# EAGLE design Xonik Waveshaper v2.0 (EAGLE 9.5.2)
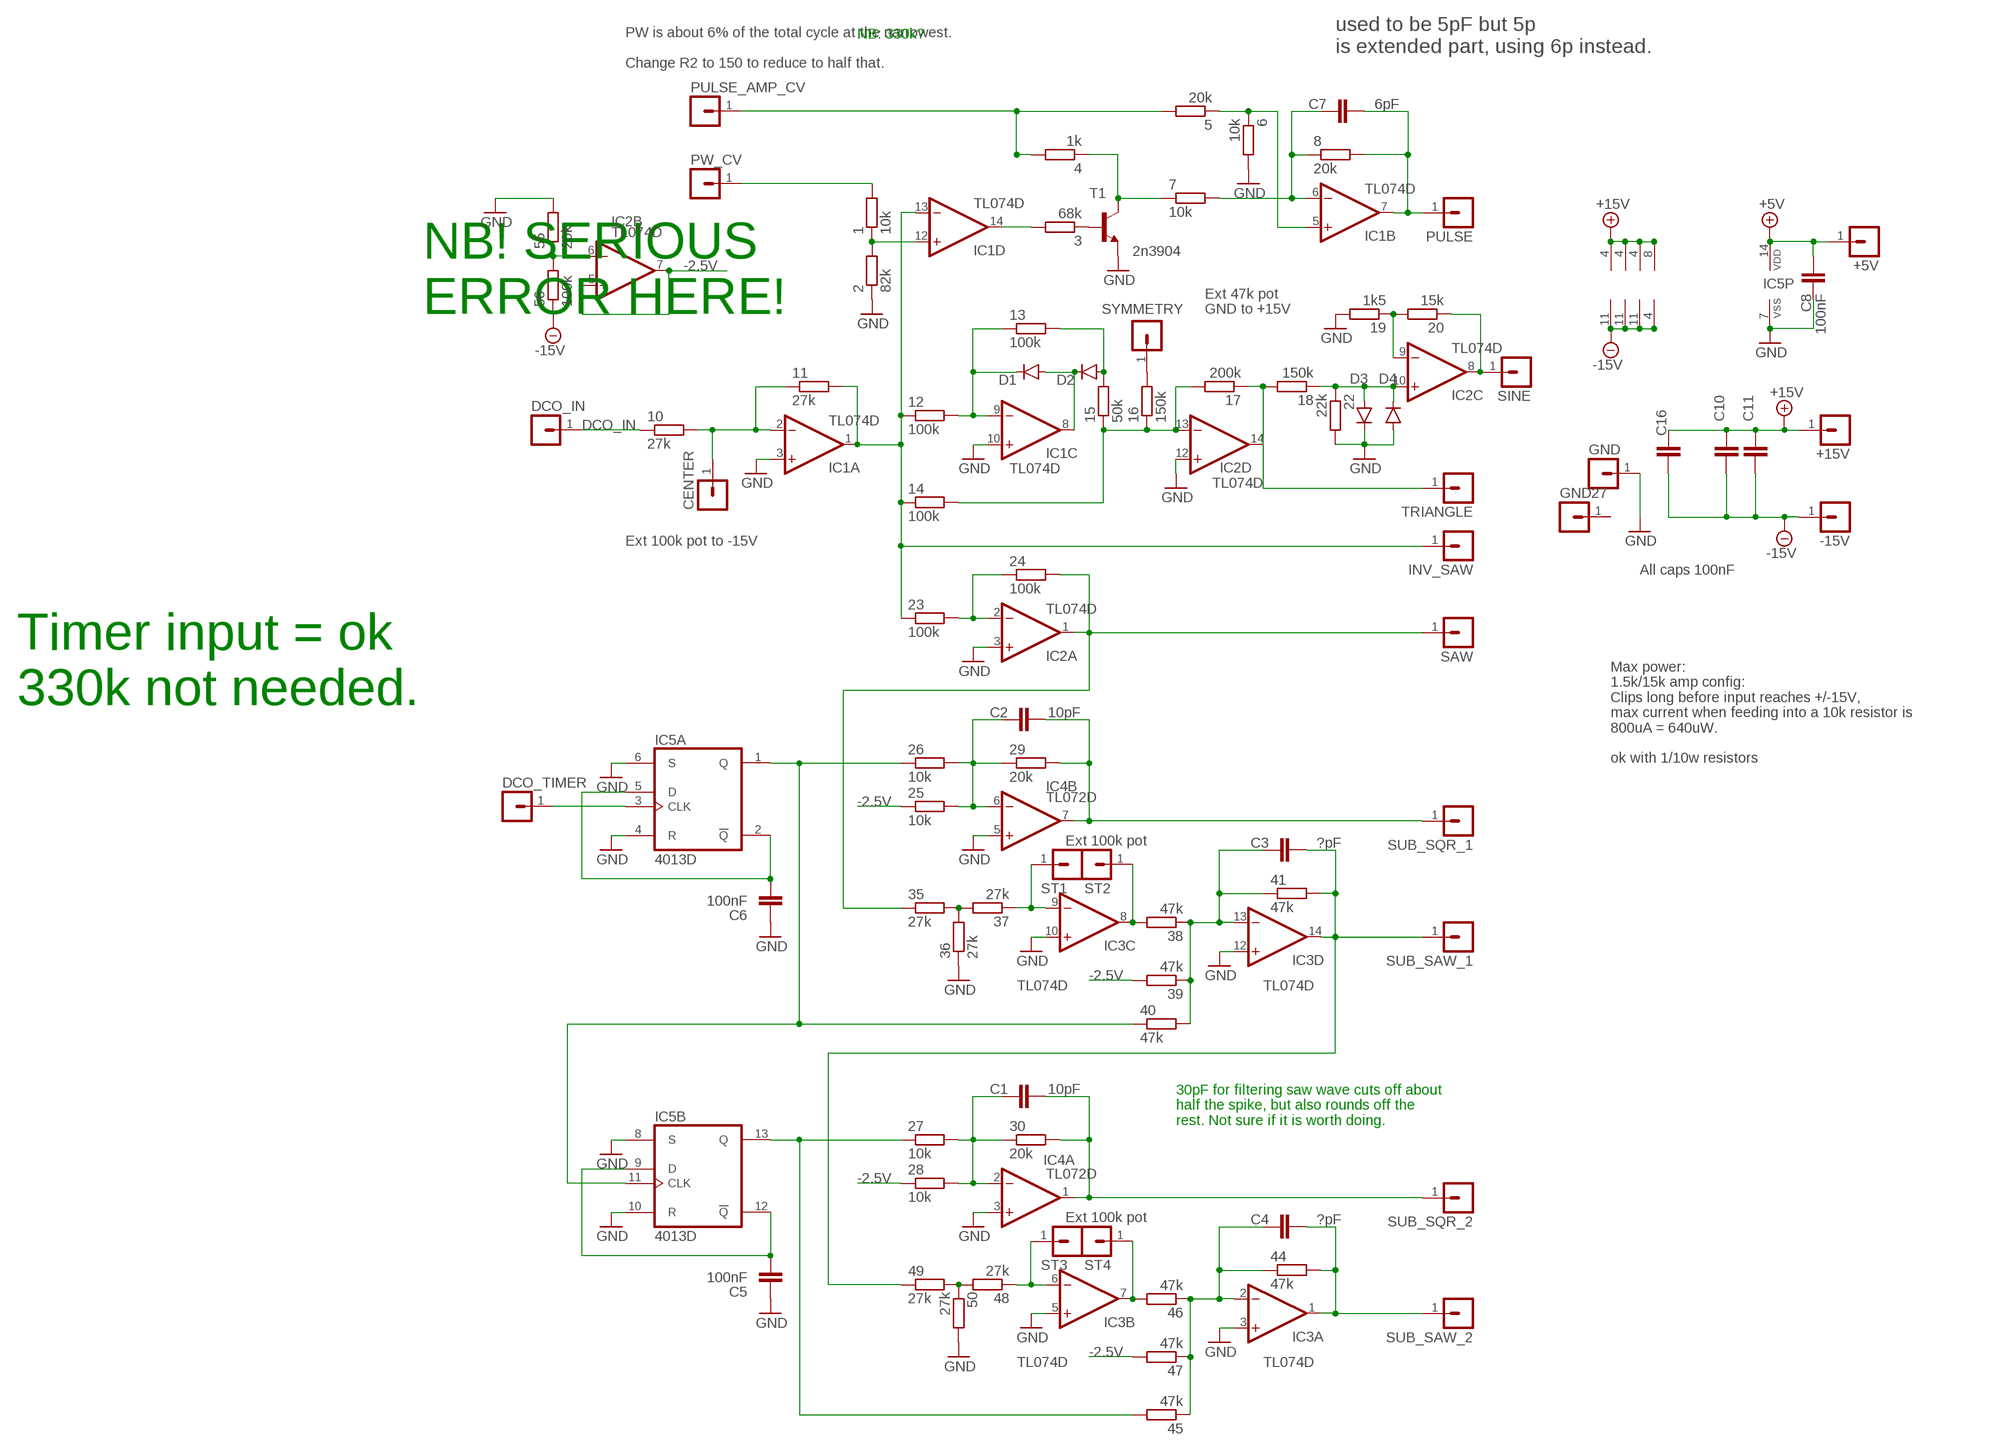
[diagram p0: schematic, sheet 1]

## Parts
1  10k  R-EU_R0805  [R0805]
2  82k  R-EU_R0805  [R0805]
3  68k  R-EU_R0805  [R0805]
4  1k  R-EU_R0805  [R0805]
5  20k  R-EU_R0805  [R0805]
6  10k  R-EU_R0805  [R0805]
7  10k  R-EU_R0805  [R0805]
8  20k  R-EU_R0805  [R0805]
10  27k  R-EU_R0805  [R0805]
11  27k  R-EU_R0805  [R0805]
12  100k  R-EU_R0805  [R0805]
13  100k  R-EU_R0805  [R0805]
14  100k  R-EU_R0805  [R0805]
15  50k  R-EU_R0805  [R0805]
16  150k  R-EU_R0805  [R0805]
17  200k  R-EU_R0805  [R0805]
18  150k  R-EU_R0805  [R0805]
19  1k5  R-EU_R0805  [R0805]
20  15k  R-EU_R0805  [R0805]
22  22k  R-EU_R0805  [R0805]
23  100k  R-EU_R0805  [R0805]
24  100k  R-EU_R0805  [R0805]
25  10k  R-EU_R0805  [R0805]
26  10k  R-EU_R0805  [R0805]
27  10k  R-EU_R0805  [R0805]
28  10k  R-EU_R0805  [R0805]
29  20k  R-EU_R0805  [R0805]
30  20k  R-EU_R0805  [R0805]
35  27k  R-EU_R0805  [R0805]
36  27k  R-EU_R0805  [R0805]
37  27k  R-EU_R0805  [R0805]
38  47k  R-EU_R0805  [R0805]
39  47k  R-EU_R0805  [R0805]
40  47k  R-EU_R0805  [R0805]
41  47k  R-EU_R0805  [R0805]
44  47k  R-EU_R0805  [R0805]
45  47k  R-EU_R0805  [R0805]
46  47k  R-EU_R0805  [R0805]
47  47k  R-EU_R0805  [R0805]
48  27k  R-EU_R0805  [R0805]
49  27k  R-EU_R0805  [R0805]
50  27k  R-EU_R0805  [R0805]
55  20k  R-EU_R0805  [R0805]
56  100k  R-EU_R0805  [R0805]
+5V  MA01-1JP  [SIP-PIN01-1J]
+15V  MA01-1JP  [SIP-PIN01-1J]
-15V  MA01-1JP  [SIP-PIN01-1J]
C1  10pF  C-EUC0805  [C0805]
C2  10pF  C-EUC0805  [C0805]
C3  ?pF  C-EUC0805  [C0805]
C4  ?pF  C-EUC0805  [C0805]
C5  100nF  C-EUC0805  [C0805]
C6  100nF  C-EUC0805  [C0805]
C7  6pF  C-EUC0805  [C0805]
C8  100nF  C-EUC0805  [C0805]
C10  100nF  C-EUC0603K  [C0603K]
C11  100nF  C-EUC0603K  [C0603K]
C16  100nF  C-EUC0603K  [C0603K]
CENTER  MA01-1JP  [SIP-PIN01-1J]
D1  1N41480805  [D0805-J]
D2  1N41480805  [D0805-J]
D3  1N41480805  [D0805-J]
D4  1N41480805  [D0805-J]
DCO_IN  MA01-1JP  [SIP-PIN01-1J]
DCO_TIMER  MA01-1JP  [SIP-PIN01-1J]
GND  MA01-1JP  [SIP-PIN01-1J]
GND27  MA01-1JP  [SIP-PIN01-1J]
IC1  TL074D  [SO14]
IC2  TL074D  [SO14]
IC3  TL074D  [SO14]
IC4  TL072D  [SO08J]
IC5  4013D  [SO14J]
INV_SAW  MA01-1JP  [SIP-PIN01-1J]
PULSE  MA01-1JP  [SIP-PIN01-1J]
PULSE_AMP_CV  MA01-1JP  [SIP-PIN01-1J]
PW_CV  MA01-1JP  [SIP-PIN01-1J]
SAW  MA01-1JP  [SIP-PIN01-1J]
SINE  MA01-1JP  [SIP-PIN01-1J]
ST1  MA01-1JP  [SIP-PIN01-1J]
ST2  MA01-1JP  [SIP-PIN01-1J]
ST3  MA01-1JP  [SIP-PIN01-1J]
ST4  MA01-1JP  [SIP-PIN01-1J]
SUB_SAW_1  MA01-1JP  [SIP-PIN01-1J]
SUB_SAW_2  MA01-1JP  [SIP-PIN01-1J]
SUB_SQR_1  MA01-1JP  [SIP-PIN01-1J]
SUB_SQR_2  MA01-1JP  [SIP-PIN01-1J]
SYMMETRY  MA01-1JP  [SIP-PIN01-1J]
T1  2n3904  MMBT3904LT1-NPN-SOT23-BEC  [SOT23-BEC]
TRIANGLE  MA01-1JP  [SIP-PIN01-1J]

## Nets
+5V: +5V.1 C8.2 IC5.14(P:VDD)
+15V: +15V.1 C10.2 C11.2 C16.2 IC1.4(P:V+) IC2.4(P:V+) IC3.4(P:V+) IC4.8(P:V+)
-2.5V: 25.1 28.1 39.2 47.2 IC2.5(B:+IN) IC2.7(B:OUT)
-15V: 56.1 -15V.1 C10.1 C11.1 C16.1 IC1.11(P:V-) IC2.11(P:V-) IC3.11(P:V-) IC4.4(P:V-)
AMP_CV: 4.2 5.2 PULSE_AMP_CV.1
DCO_IN: 10.1 DCO_IN.1
GND: 2.1 6.2 19.2 22.2 36.1 50.2 55.2 C5.1 C6.1 C8.1 D3.C D4.A GND.1 IC1.3(A:+IN) IC1.10(C:+IN) IC2.3(A:+IN) IC2.12(D:+IN) IC3.3(A:+IN) IC3.5(B:+IN) IC3.10(C:+IN) IC3.12(D:+IN) IC4.3(A:+IN) IC4.5(B:+IN) IC5.4(A:R) IC5.6(A:S) IC5.7(P:VSS) IC5.8(B:S) IC5.10(B:R) T1.E
N$1: 1.1 2.2 IC1.12(D:+IN)
N$2: 3.2 IC1.14(D:OUT)
N$3: 3.1 T1.B
N$4: 4.1 7.1 T1.C
N$5: 5.1 6.1 IC1.5(B:+IN)
N$6: 7.2 8.1 C7.1 IC1.6(B:-IN)
N$7: 8.2 C7.2 IC1.7(B:OUT) PULSE.1
N$9: 11.2 12.1 14.1 23.1 IC1.1(A:OUT) IC1.13(D:-IN) INV_SAW.1
N$10: 10.2 11.1 CENTER.1 IC1.2(A:-IN)
N$11: 12.2 13.1 D1.C IC1.9(C:-IN)
N$12: D1.A D2.C IC1.8(C:OUT)
N$13: 13.2 15.2 D2.A
N$14: 14.2 15.1 16.1 17.2 IC2.13(D:-IN)
N$15: 23.2 24.1 IC2.2(A:-IN)
N$16: 24.2 35.1 IC2.1(A:OUT) SAW.1
N$17: 29.2 C2.2 IC4.7(B:OUT) SUB_SQR_1.1
N$18: 30.2 C1.2 IC4.1(A:OUT) SUB_SQR_2.1
N$19: 25.2 26.2 29.1 C2.1 IC4.6(B:-IN)
N$20: 46.2 IC3.7(B:OUT) ST4.1
N$21: 48.2 49.2 50.1
N$22: 27.2 28.2 30.1 C1.1 IC4.2(A:-IN)
N$23: 35.2 36.2 37.2
N$24: 37.1 IC3.9(C:-IN) ST1.1
N$26: 38.1 39.1 40.2 41.1 C3.1 IC3.13(D:-IN)
N$27: 41.2 49.1 C3.2 IC3.14(D:OUT) SUB_SAW_1.1
N$28: 48.1 IC3.6(B:-IN) ST3.1
N$29: 44.1 45.1 46.1 47.1 C4.1 IC3.2(A:-IN)
N$30: 44.2 C4.2 IC3.1(A:OUT) SUB_SAW_2.1
N$31: C6.2 IC5.2(A:!Q) IC5.5(A:D)
N$32: 26.1 40.1 IC5.1(A:Q) IC5.11(B:CLK)
N$33: 55.1 56.2 IC2.6(B:-IN)
N$34: C5.2 IC5.9(B:D) IC5.12(B:!Q)
N$35: 27.1 45.2 IC5.13(B:Q)
N$36: 19.1 20.2 IC2.9(C:-IN)
N$37: 16.2 SYMMETRY.1
N$38: 17.1 18.2 IC2.14(D:OUT) TRIANGLE.1
N$39: 18.1 22.1 D3.A D4.C IC2.10(C:+IN)
N$40: 20.1 IC2.8(C:OUT) SINE.1
N$41: 38.2 IC3.8(C:OUT) ST2.1
PW_CV: 1.2 PW_CV.1
SQR: DCO_TIMER.1 IC5.3(A:CLK)
Unconnected: GND27.1

## Notes on the sheet
- NB: 330k?
- used to be 5pF but 5p
  is extended part, using 6p instead.
- PW is about 6% of the total cycle at the narrowest.
  
  Change R2 to 150 to reduce to half that.
- NB! SERIOUS
  ERROR HERE!
- Ext 47k pot 
  GND to +15V
- Ext 100k pot to -15V
- All caps 100nF
- Timer input = ok
  330k not needed.
- Max power:
  1.5k/15k amp config:
  Clips long before input reaches +/-15V,
  max current when feeding into a 10k resistor is
  800uA = 640uW. 
  
  ok with 1/10w resistors
- Ext 100k pot
- 30pF for filtering saw wave cuts off about
  half the spike, but also rounds off the
  rest. Not sure if it is worth doing.
- Ext 100k pot

## Library data of the parts
1-8 10-20 22-30 35-41 44-50 55 56 = resistor:R-EU_: RESISTOR, European symbol
+5V +15V -15V CENTER DCO_IN DCO_TIMER GND GND27 INV_SAW PULSE PULSE_AMP_CV PW_CV SAW SINE ST1-ST4 SUB_SAW_1 SUB_SAW_2 SUB_SQR_1 SUB_SQR_2 SYMMETRY TRIANGLE = joakim:MA01-1J: PIN HEADER
C1-C8 C10 C11 C16 = resistor:C-EU: CAPACITOR, European symbol
D1-D4 = joakim:1N4148: DIODE high speed (Philips)
IC1-IC3 = linear:TL074: OP AMP
IC4 = joakim:TL072: OP AMP
IC5 = joakim:4013: Dual D FLIP FLOP, set/reset
T1 = transistor-neu-to92:*-NPN-: NPN Transistror

## Board
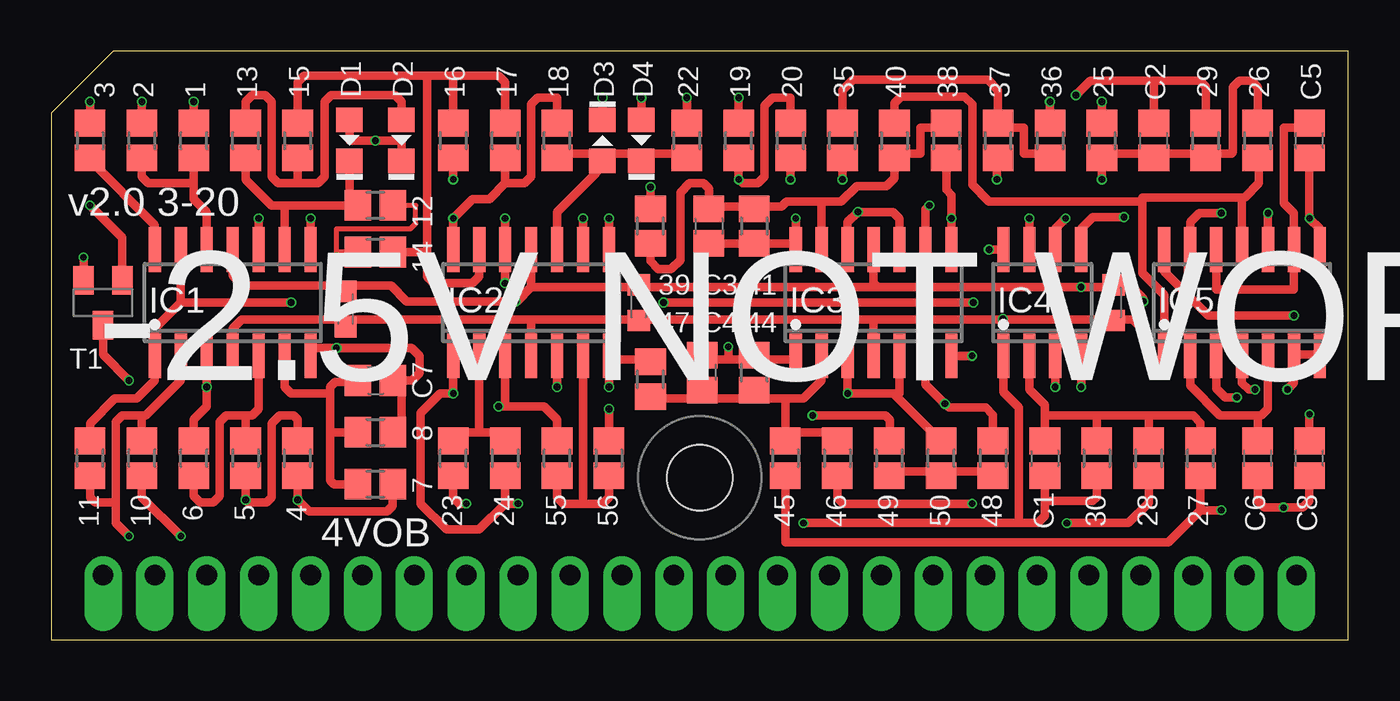
[diagram p1: board, top side]
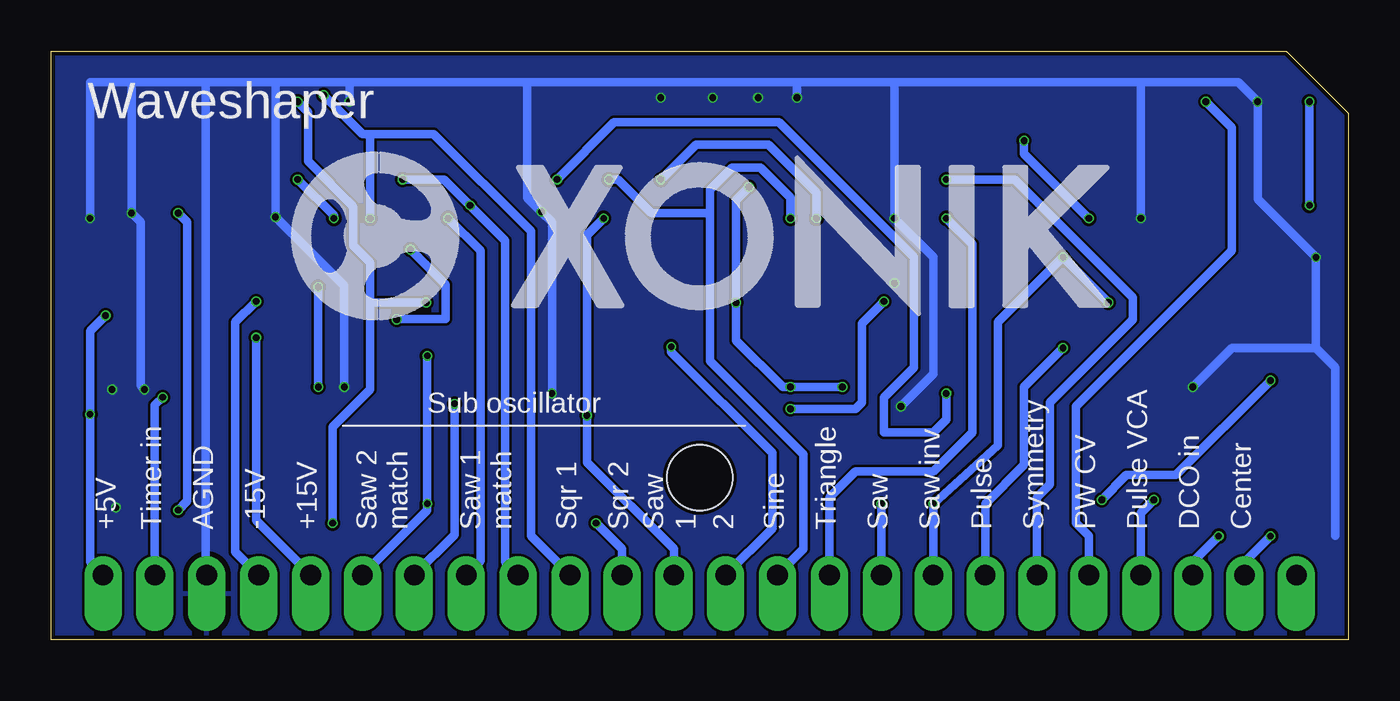
[diagram p2: board, bottom side, seen from below]

Size 63.5 x 28.83 mm. Coordinates in mm from the lower left corner, seen from the top.
Outline: 0,0 63.5,0 63.5,28.83 3.05,28.83 0,25.78 0,0
Copper layers (1*16): Top 0.035mm / dielectric 1.6mm / Bottom 0.035mm
Design rules "jlcpcb-2layers": minimum track width 5mil, minimum drill 0.3mm, track to track 5mil, track to pad 5mil, pad to pad 5mil, via to via 5mil, smd to smd 5mil, copper to edge 0.2mm, drill to drill 6mil, minimum pad ring 10mil, minimum via ring 3mil, stop-mask expansion 4mil, vias tented up to drill 0mil, thermal gap 10mil
Holes 3.2 mm at 31.75,7.94

### Footprints (pad centres in the part's own frame; a part is rotated, then mirrored left to right if it is on the bottom)
R0805 = smd 1.3 x 1.5: 1 -0.85,0; 2 0.85,0
SIP-PIN01-1J = drill 1.016 offset: 1 0,0
C0805 = smd 1.3 x 1.5: 1 -0.85,0; 2 0.85,0
C0603K = smd 1.05 x 1.08: 1 -0.875,0; 2 0.875,0
D0805-J = smd 1.2 x 1.3: A -1,0; C 1,0
SO14 = smd 0.6 x 2.2: 1 -3.81,-2.6; 2 -2.54,-2.6; 3 -1.27,-2.6; 4 0,-2.6; 5 1.27,-2.6; 6 2.54,-2.6; 7 3.81,-2.6; 8 3.81,2.6; 9 2.54,2.6; 10 1.27,2.6; 11 0,2.6; 12 -1.27,2.6; 13 -2.54,2.6; 14 -3.81,2.6
SO08J = smd 0.6 x 2.2: 1 -1.905,-2.6; 2 -0.635,-2.6; 3 0.635,-2.6; 4 1.905,-2.6; 5 1.905,2.6; 6 0.635,2.6; 7 -0.635,2.6; 8 -1.905,2.6
SO14J = smd 0.6 x 2.2: 1 -3.81,-2.6; 2 -2.54,-2.6; 3 -1.27,-2.6; 4 0,-2.6; 5 1.27,-2.6; 6 2.54,-2.6; 7 3.81,-2.6; 8 3.81,2.6; 9 2.54,2.6; 10 1.27,2.6; 11 0,2.6; 12 -1.27,2.6; 13 -2.54,2.6; 14 -3.81,2.6
SOT23-BEC = smd 1 x 1.4: B -0.95,-1.1; C 0,1.1; E 0.95,-1.1

### Placement (x,y rotation side)
1  6.99,24.45 90 top
2  4.45,24.45 270 top
3  1.91,24.45 270 top
4  12.06,8.89 90 top
5  9.53,8.89 270 top
6  6.99,8.89 90 top
7  15.88,7.62 180 top
8  15.88,10.16 0 top
10  4.45,8.89 90 top
11  1.91,8.89 90 top
12  15.88,21.27 180 top
13  9.53,24.45 90 top
14  15.88,18.99 0 top
15  12.06,24.45 270 top
16  19.68,24.45 270 top
17  22.23,24.45 90 top
18  24.77,24.45 90 top
19  33.66,24.45 90 top
20  36.2,24.45 90 top
22  31.11,24.45 90 top
23  19.68,8.89 90 top
24  22.23,8.89 270 top
25  51.44,24.45 270 top
26  59.05,24.45 90 top
27  56.26,8.89 90 top
28  53.72,8.89 90 top
29  56.52,24.45 90 top
30  51.18,8.89 270 top
35  38.73,24.45 90 top
36  48.9,24.45 270 top
37  46.35,24.45 90 top
38  43.81,24.45 270 top
39  29.34,20.26 90 top
40  41.27,24.45 270 top
41  34.42,20.26 270 top
44  34.42,13.08 90 top
45  35.94,8.89 270 top
46  38.48,8.89 270 top
47  29.34,12.76 90 top
48  46.1,8.89 270 top
49  41.02,8.89 270 top
50  43.56,8.89 90 top
55  24.77,8.89 90 top
56  27.3,8.89 270 top
+5V  60.96,3.17 0 top
+15V  50.8,3.17 0 top
-15V  53.34,3.17 0 top
C1  48.64,8.89 270 top
C2  53.98,24.45 90 top
C3  32.19,20.26 270 top
C4  31.88,13.08 90 top
C5  61.59,24.45 90 top
C6  59.05,8.89 90 top
C7  15.88,12.7 0 top
C8  61.59,8.89 90 top
C10  28.77,16.51 270 top
C11  14.41,16.19 270 top
C16  52.01,16.51 270 top
CENTER  5.08,3.17 0 top
D1  14.61,24.45 270 top
D2  17.14,24.45 270 top
D3  26.99,24.45 90 top
D4  28.89,24.45 270 top
DCO_IN  7.62,3.17 0 top
DCO_TIMER  58.42,3.17 0 top
GND  55.88,3.17 0 top
GND27  2.54,3.17 0 top
IC1  8.89,16.51 0 top
IC2  23.5,16.51 0 top
IC3  40.26,16.51 0 top
IC4  48.51,16.51 0 top
IC5  58.29,16.51 0 top
INV_SAW  20.32,3.17 0 top
PULSE  17.78,3.17 0 top
PULSE_AMP_CV  10.16,3.17 0 top
PW_CV  12.7,3.17 0 top
SAW  22.86,3.17 0 top
SINE  27.94,3.17 0 top
ST1  40.64,3.17 0 top
ST2  43.18,3.17 0 top
ST3  45.72,3.17 0 top
ST4  48.26,3.17 0 top
SUB_SAW_1  33.02,3.17 0 top
SUB_SAW_2  30.48,3.17 0 top
SUB_SQR_1  38.1,3.17 0 top
SUB_SQR_2  35.56,3.17 0 top
SYMMETRY  15.24,3.17 0 top
T1  2.54,16.51 180 top
TRIANGLE  25.4,3.17 0 top
U$1  [XONIK_LOGO_40]  51.72,15.7 0 bottom

### Tracks (layer width: path | path; a pad name or v marks a point on that pad's centre or on a via)
+5V  (via drill 0.33)
  Top 0.406: v60.83,15.88 56.64,15.88 54.48,18.03 IC5.14 | v61.59,11.05 C8.2
  Bottom 0.406: +5V.1 61.59,3.81 v61.59,11.05 61.59,15.11 v60.83,15.88
+15V  (via drill 0.33, 0.35)
  Top 0.152: IC1.4 8.89,14.03
  Top 0.406: 8.89,14.03 8.89,15.24 9.34,15.68 14.29,15.68 | 14.29,15.68 23.5,15.68 | 23.5,15.68 28.72,15.68 C10.2 28.82,15.68 40.26,15.68 | IC2.4 23.5,15.68 | IC3.4 40.26,15.68 | IC4.8 v45.91,19.11 | C11.2 14.41,15.56 14.29,15.68 | 51.96,15.68 C16.2 | 40.26,15.68 46.57,15.68 | 46.57,15.68 51.96,15.68 | v46.58,15.7 46.57,15.68 | v53.47,14.8 53.47,15.18 52.96,15.68 51.96,15.68
  Bottom 0.406: +15V.1 53.47,5.84 v53.47,14.8 | v45.91,19.11 44.2,17.4 44.2,15.7 v46.58,15.7
-2.5V  (via drill 0.33)
  Top 0.406: v29.97,16.51 v45.15,16.51 | 28.1 53.72,6.71 52.73,5.71 v49.72,5.71 | v51.44,26.35 25.1 | v27.3,12.38 IC2.7 27.5,13.72 29.34,13.72 47.2 | 39.2 v29.34,22.16 | IC2.5 v24.77,12.38
  Bottom 0.406: v29.34,22.16 29.97,21.53 v29.97,16.51 29.97,14.67 27.69,12.38 v27.3,12.38 v24.77,12.38 | v49.72,5.71 49.72,10.41 47.88,12.26 47.88,16.51 | v51.44,26.35 50.93,25.84 50.93,23.43 48.7,21.21 48.7,19.3 47.88,18.48 47.88,16.51 | 47.88,16.51 v45.15,16.51
-15V  (via drill 0.33)
  Top 0.406: IC1.11 8.89,17.84 9.4,17.34 14.41,17.34 | 23.5,17.27 22.8,16.57 v22.73,16.57 17.4,16.57 16.64,17.34 14.41,17.34 | 23.5,17.27 28.65,17.27 | 28.65,17.27 40.45,17.27 | 40.45,17.27 40.26,17.46 IC3.11 | 40.45,17.27 v50.42,17.27 51.89,17.27 C16.1 52.12,17.27 52.9,17.27 53.47,16.7 v53.47,16.57 | v27.3,11.3 56.1 | IC4.4 v50.42,12.38 | C11.1 14.41,17.34 | 23.5,17.27 IC2.11 | C10.1 28.65,17.27
  Bottom 0.406: v27.3,11.3 24.13,11.3 23.81,11.62 23.81,15.49 v22.73,16.57 | -15V.1 54.48,4.32 54.48,15.56 v53.47,16.57 | v50.42,12.38 v50.42,17.27
AMP_CV  (via drill 0.33)
  Top 0.406: 5.2 v9.53,6.86 9.65,6.73 10.54,6.73 10.79,6.99 10.79,10.6 11.18,10.99 11.87,10.99 12.06,10.79 4.2
  Bottom 0.406: v9.53,6.86 10.16,6.22 PULSE_AMP_CV.1
DCO_IN  (via drill 0.33)
  Top 0.406: 10.1 4.45,6.99 v6.35,5.08
  Bottom 0.406: v6.35,5.08 7.62,3.81 DCO_IN.1
GND  (via drill 0.33)
  Top 0.305: 62.1,13.97 IC5.7
  Top 0.406: IC3.12 38.99,20.45 v39.5,20.95 41.21,20.95 41.53,20.63 IC3.10 | IC3.5 41.53,12.06 41.24,12.06 | IC3.3 v38.99,12.06 41.24,12.06 | C5.1 v61.59,20.64 62.1,20.13 IC5.8 | 60.89,13.97 60.83,13.97 | v52.51,20.7 50.99,20.7 50.42,20.13 IC4.5 | 41.24,12.06 50.2 | v22.23,20.64 IC2.12 v22.23,17.46 | IC2.3 22.23,11.43 v21.91,11.43 24.13,11.43 24.77,10.79 55.2 | v59.56,20.89 IC5.10 | IC4.3 v49.15,12.38 | 26.99,25.08 D3.C v26.99,26.54 | 29.21,25.08 D4.A v28.89,26.54 | 31.43,25.08 22.2 v31.11,26.54 | 33.66,25.08 19.2 v33.66,26.54 | IC5.4 58.29,12.58 58.61,12.26 v58.93,12.26 | 6.2 6.99,10.79 7.62,11.43 IC1.3 v7.62,12.38 | IC1.10 v10.16,20.64 | 2.1 v4.45,26.35 | 36.1 v48.9,26.35 | T1.E v1.59,18.73 | v60.52,12.26 60.83,12.57 IC5.6 60.89,13.97 | C6.1 59.05,6.79 59.37,6.48 v60.33,6.48 61.28,6.48 61.59,6.79 C8.1 | 60.89,13.97 62.1,13.97
  Bottom 0.406: v61.59,20.64 61.59,27.3 59.56,27.3 | 59.56,27.3 55.94,27.3 | 55.94,27.3 52.51,27.3 | 52.51,27.3 v52.51,20.7 49.15,17.34 v49.15,12.38 | 40.2,27.3 40.2,21.65 v39.5,20.95 38.99,20.45 v38.99,12.06 | 40.2,27.3 48.9,27.3 | 48.9,27.3 52.51,27.3 | 26.99,27.3 40.2,27.3 | v21.91,11.43 20.32,13.02 20.32,18.73 v22.23,20.64 22.23,27.3 | 59.56,27.3 v59.56,20.89 59.12,20.45 59.12,12.45 v58.93,12.26 | GND.1 55.94,3.24 55.94,27.3 | v10.16,20.64 10.16,27.3 | 10.16,27.3 22.23,27.3 | 22.23,27.3 26.99,27.3 | 26.99,27.3 v26.99,26.54 | 10.16,27.3 5.4,27.3 v4.45,26.35 4.45,21.59 v1.59,18.73 1.59,14.29 | 0.64,5.08 0.64,13.34 1.59,14.29 | 1.59,14.29 5.71,14.29 v7.62,12.38 | v48.9,26.35 48.9,27.3
  pour Bottom: -0.51,29.02 64.2,29.02 64.52,28.7 64.52,0 64.07,-0.44 -0.51,-0.44 -0.83,-0.13 -0.83,28.7
N$1
  Top 0.406: IC1.12 7.62,20.95 6.99,21.59 6.99,22.35 | 1.1 6.99,23.81 | 2.2 4.45,22.67 4.76,22.35 6.99,22.35 | 1.1 6.99,22.48 | 1.1 6.99,22.35
N$2
  Top 0.406: 3.2 1.91,23.5 5.08,20.32 IC1.14
N$3  (via drill 0.33)
  Top 0.406: v1.91,21.27 3.49,19.68 3.49,17.29 T1.B | v1.91,26.35 3.1
  Bottom 0.406: v1.91,21.27 v1.91,26.35
N$4  (via drill 0.33)
  Top 0.406: T1.C 2.54,13.97 v3.81,12.7 | 7.1 16.73,6.57 16.45,6.29 12.64,6.29 v12.06,6.86 4.1
  Bottom 0.406: v3.81,12.7 8.45,8.06 10.86,8.06 v12.06,6.86
N$5
  Top 0.406: 6.99,8.26 6.1 6.99,7.05 7.3,6.73 7.94,6.73 8.26,7.05 8.26,10.67 8.57,10.99 9.53,10.99 | IC1.5 10.16,11.3 9.84,10.99 9.53,10.99 | 9.53,9.53 5.1 9.53,10.99
N$6
  Top 0.406: IC1.6 11.43,12.38 11.75,12.06 13.65,12.06 | 14.61,12.7 C7.1 14.96,12.64 13.91,12.64 13.65,12.38 13.65,12.06 | 14.61,7.62 7.2 13.84,7.62 13.65,7.81 13.65,10.16 | 13.65,12.06 13.65,10.16 | 8.1 13.65,10.16
N$7  (via drill 0.33)
  Top 0.406: IC1.7 12.7,14.29 v13.97,14.29 17.65,14.29 18.03,13.91 18.03,13.06 17.68,12.7 C7.2 17.14,12.28 17.14,10.48 16.83,10.16 8.2
  Bottom 0.406: PULSE.1 17.78,6.67 15.88,8.57 15.88,12.38 v13.97,14.29
N$9  (via drill 0.33)
  Top 0.254: 12.1 17.84,21.27 17.84,20.38 17.59,20.13 13.97,20.13 13.97,18.99 | v13.97,18.73 13.97,18.99 | 14.1 13.97,18.99
  Top 0.406: 11.2 1.91,10.6 3.11,11.81 4.19,11.81 5.08,12.7 IC1.1 5.08,15.24 6.35,16.51 | 6.35,16.51 IC1.13 | 14.1 15.24,19.3 15.24,18.73 | 16.51,21.17 12.1 | v11.75,16.51 6.35,16.51 | 23.1 19.68,6.99 20,6.67 v20.32,6.67
  Bottom 0.406: v11.75,16.51 v13.97,18.73 17.14,15.56 17.14,9.53 v20.32,6.67 INV_SAW.1
N$10  (via drill 0.33)
  Top 0.406: 3.17,6.73 3.17,10.67 3.49,10.99 4.51,10.99 | 3.17,6.73 2.16,6.73 1.91,6.99 11.1 | IC1.2 6.35,12.7 4.64,10.99 4.51,10.99 | 4.51,10.99 4.45,10.92 10.2 | v3.81,5.08 3.17,5.71 3.17,6.73
  Bottom 0.406: v3.81,5.08 5.08,3.81 CENTER.1
N$11
  Top 0.406: 13.1 9.53,22.54 10.79,21.27 11.43,21.27 | 11.43,21.27 IC1.9 | 14.61,21.59 15.24,21.59 15.03,21.38 12.2 | 11.43,21.27 14.61,21.27 14.61,21.59 | D1.C 14.61,21.59
N$12  (via drill 0.33)
  Top 0.406: v12.7,20.64 IC1.8 | 14.61,25.72 D1.A 14.61,24.45 v15.88,24.45 17.14,24.45 D2.C
  Bottom 0.406: v15.88,24.45 15.88,23.81 v12.7,20.64
N$13
  Top 0.406: D2.A 17.14,26.35 16.83,26.67 13.72,26.67 13.4,26.35 13.4,22.67 13.08,22.35 12.06,22.35 | 13.2 9.53,26.35 9.84,26.67 10.48,26.67 10.79,26.35 10.79,22.67 11.11,22.35 12.06,22.35 | 15.2 12.06,22.35
N$14
  Top 0.406: 15.1 12.06,27.3 12.38,27.62 18.41,27.62 | 18.41,27.62 19.68,27.62 | 19.68,27.62 16.1 | 17.2 22.23,27.3 21.91,27.62 19.68,27.62 | 14.2 18.41,18.99 | 18.41,18.99 18.41,27.62 | IC2.13 20.95,17.78 20.64,17.46 18.73,17.46 18.41,17.78 18.41,18.99
N$15
  Top 0.406: 23.2 19.68,10.16 20.95,10.16 | 24.1 21.8,10.16 20.95,10.16 | 20.95,10.16 IC2.2
N$16  (via drill 0.33)
  Top 0.406: 24.2 22.23,6.67 | IC2.1 v19.68,12.06 19.05,12.06 18.1,11.11 18.1,6.67 19.37,5.4 20.95,5.4 22.23,6.67 | 35.1 v38.73,22.54 | v22.86,6.67 22.23,6.67
  Bottom 0.406: v19.68,12.06 19.68,10.79 20.32,10.16 22.73,10.16 22.73,11.87 21.27,13.34 21.27,18.73 27.88,25.34 35.94,25.34 v38.73,22.54 | v22.86,6.67 SAW.1
N$17  (via drill 0.33)
  Top 0.406: 53.98,27.33 C2.2 53.98,27.37 | IC4.7 v47.88,20.64 | 53.98,27.37 50.86,27.37 v50.16,26.67 | 29.2 56.52,27.08 56.22,27.37 53.98,27.37
  Bottom 0.406: 47.88,24.77 48.26,24.77 v50.16,26.67 | SUB_SQR_1.1 40.01,5.08 40.01,20 44.77,24.77 47.88,24.77 | 47.88,24.77 v47.88,20.64
N$18  (via drill 0.33)
  Top 0.406: IC4.1 46.61,12.13 47.37,11.37 47.37,5.71 | 48.64,6.79 C1.2 48.64,7.94 48.96,8.26 | 48.64,6.79 48.64,6.07 48.32,5.75 48.32,5.71 47.37,5.71 | 47.37,5.71 v36.83,5.71 | 50.76,8.26 30.2 51.18,6.99 50.99,6.79 48.64,6.79
  Bottom 0.406: SUB_SQR_2.1 35.56,4.45 v36.83,5.71
N$19  (via drill 0.33)
  Top 0.406: 56.52,23.81 54.29,23.81 | C2.1 54.29,23.81 | 54.29,23.81 51.54,23.81 25.2 v51.44,22.54 | v49.66,20.64 v49.66,20.63 49.15,20.13 IC4.6 | 29.1 56.52,23.81 | 56.52,23.81 57.78,23.81 57.85,23.88 57.85,27.05 58.17,27.37 58.74,27.37 59.05,27.05 26.2 59.05,25.08
  Bottom 0.406: v51.44,22.54 49.66,20.77 v49.66,20.64
N$20  (via drill 0.33)
  Top 0.406: v45.09,6.67 38.77,6.67 38.48,6.96 46.2 | v45.09,13.91 IC3.7
  Bottom 0.406: v45.09,13.91 v45.09,6.67 45.09,6.35 ST4.1
N$21
  Top 0.406: 48.2 46.1,8.26 43.98,8.26 50.1 43.35,8.26 41.02,8.26 49.2
N$22
  Top 0.406: 51.18,10.99 48.64,10.99 C1.1 48.64,11.49 47.88,12.26 IC4.2 | 27.2 56.26,10.63 55.9,10.99 53.72,10.99 | 30.1 51.18,10.99 | 51.18,10.99 53.72,10.99 | 28.2 53.72,10.99
N$23
  Top 0.406: 35.2 38.73,26.92 39.24,27.43 45.85,27.43 46.35,26.92 46.35,25.4 | 37.2 46.35,25.4 | 46.35,25.4 46.67,25.08 47.62,25.08 47.62,23.81 48.26,23.81 48.48,23.6 36.2
N$24  (via drill 0.33)
  Top 0.406: v42.99,21.27 42.8,21.08 IC3.9 | 37.1 46.29,23.53 v46.29,22.54
  Bottom 0.406: ST1.1 41.27,3.81 41.27,19.56 v42.99,21.27 44.26,22.54 v46.29,22.54
N$26
  Top 0.406: IC3.13 37.72,21.46 | 37.72,21.46 38.67,21.46 39.43,22.23 40.89,22.23 41.27,22.61 40.2 41.27,23.81 42.55,23.81 42.55,25.08 43.18,25.08 43.4,25.3 38.1 | 37.72,21.46 36.01,21.46 35.75,21.21 34.42,21.21 | 34.42,21.21 32.3,21.21 C3.1 32.19,22.1 31.94,22.35 31.24,22.35 30.8,21.91 30.8,18.61 30.35,18.16 29.72,18.16 29.34,18.54 39.1 | 41.1 34.42,21.21
N$27  (via drill 0.33)
  Top 0.406: v36.45,20.64 IC3.14 36.42,19.13 36.42,19.3 36.32,19.41 41.2 C3.2 | 49.1 41.06,9.78 41.06,10.76 40.83,10.99 v37.27,10.99
  Bottom 0.406: v36.45,20.64 37.27,19.81 v37.27,10.99 37.27,8.7 33.02,4.45 SUB_SAW_1.1
N$28  (via drill 0.33)
  Top 0.406: IC3.6 42.8,12.51 v43.75,11.56 43.94,11.37 45.74,11.37 46.1,11.01 48.1 46.1,9.53
  Bottom 0.406: v43.75,11.56 43.75,5.14 ST3.1
N$29
  Top 0.406: 46.1 38.48,10.16 36.36,10.16 45.1 35.94,11.81 | IC3.2 37.72,12.7 36.83,11.81 35.94,11.81 | 47.1 29.34,11.81 31.46,11.81 C4.1 31.88,11.81 34,11.81 | 34,11.81 34.42,11.81 | 34.42,11.81 35.94,11.81 | 34,11.81 44.1 34.42,11.81
N$30  (via drill 0.33)
  Top 0.406: C4.2 31.88,13.72 34.2,13.72 44.2 34.42,13.72 | IC3.1 36.26,13.72 34.42,13.72 | 34.42,13.72 33.15,13.72 v33.15,14.35
  Bottom 0.406: v33.15,14.35 33.15,14.1 28.19,9.14 28.19,5.46 SUB_SAW_2.1
N$31
  Top 0.406: 59.05,10.99 57.21,10.99 55.75,12.45 IC5.2 | 59.05,10.99 59.24,10.99 59.56,11.3 IC5.5 | C6.2 59.05,10.99
N$32
  Top 0.406: IC5.11 58.29,21.65 | 58.29,21.65 58.42,21.65 59.12,22.35 59.12,23.53 26.1 | 40.1 41.27,26.29 41.59,26.61 44.7,26.61 45.09,26.23 45.09,22.29 45.91,21.46 53.4,21.46 | IC5.1 54.48,16.89 53.4,17.97 53.4,21.46 | 58.29,21.65 53.4,21.65 53.4,21.46
N$33
  Top 0.406: 55.1 24.77,6.99 25.08,6.67 26.04,6.67 | IC2.6 26.04,6.67 | 56.2 27.3,6.99 26.99,6.67 26.04,6.67
N$34
  Top 0.406: C5.2 61.59,25.08 60.33,25.08 60.33,21.4 60.83,20.89 IC5.9 60.83,17.14 57.02,17.14 IC5.12
N$35  (via drill 0.33)
  Top 0.406: v57.28,20.89 56.2,20.89 55.75,20.45 IC5.13 | 45.2 35.94,4.76 54.67,4.76 56.26,6.35 | 56.26,6.35 27.1 | v57.28,6.35 56.26,6.35
  Bottom 0.406: v57.28,6.35 56.83,6.79 56.83,20.45 v57.28,20.89
N$36  (via drill 0.33)
  Top 0.406: IC2.9 v26.04,20.64 | 36.2,25.08 20.2 36.2,26.54 35.31,26.54 34.92,26.16 34.92,22.67 34.61,22.35 33.85,22.35 v33.66,22.54 19.1
  Bottom 0.406: v26.04,20.64 26.04,21.91 28.38,24.26 31.94,24.26 v33.66,22.54
N$37  (via drill 0.33)
  Top 0.406: 16.2 v19.68,22.54
  Bottom 0.406: v19.68,22.54 16.32,22.54 10.54,16.76 10.54,15.68 14.61,11.62 14.61,7.62 15.24,6.99 SYMMETRY.1
N$38  (via drill 0.33)
  Top 0.406: IC2.14 v19.68,20.64 20.64,21.59 21.46,21.59 22.23,22.35 | 24.77,25.08 18.2 24.77,26.54 23.81,26.54 23.5,26.23 23.5,22.67 23.18,22.35 22.23,22.35 | 22.23,22.35 17.1
  Bottom 0.406: TRIANGLE.1 25.4,6.99 24.13,8.26 20.32,8.26 18.41,10.16 18.41,19.37 v19.68,20.64
N$39
  Top 0.406: IC2.10 24.77,20.95 26.67,22.86 D3.A | D3.A 26.67,23.81 28.57,23.81 | 29.26,23.81 D4.C 28.57,23.81 | 28.57,23.81 29.26,23.81 | 29.26,23.81 31.01,23.81 22.1 | 18.1 24.77,23.81 26.4,23.81 D3.A
N$40  (via drill 0.33)
  Top 0.406: v27.3,20.64 IC2.8 | 20.1 v36.2,22.54
  Bottom 0.406: SINE.1 26.67,4.45 26.67,9.08 31.24,13.65 31.24,20.89 | 31.24,20.89 31.24,22.04 30.16,23.11 28.77,23.11 27.3,21.65 v27.3,20.64 | v36.2,22.54 35.75,22.54 34.1,20.89 31.24,20.89
N$41  (via drill 0.33)
  Top 0.406: IC3.8 v44.07,20.64 44.07,21.78 43.81,22.04 38.2
  Bottom 0.406: v44.07,20.64 42.48,19.05 42.48,3.87 ST2.1
PW_CV  (via drill 0.33)
  Top 0.406: 1.2 v6.99,26.35
  Bottom 0.406: v6.99,26.35 5.71,25.08 5.71,19.05 13.34,11.43 13.34,5.71 12.7,5.08 PW_CV.1
SQR  (via drill 0.33)
  Top 0.406: IC5.3 57.02,12.32 57.47,11.87 v58.04,11.87
  Bottom 0.406: v58.04,11.87 58.42,11.49 DCO_TIMER.1

### Text on the board
tNames: 3 | 2 | 1 | 13 | 15 | D1 | D2 | 16 | 17 | 18 | D3 | D4 | 22 | 19 | 20 | 35 | 40 | 38 | 37 | 36 | 25 | 29 | 26 | C2 | C5 | v2.0 3-20 | 12 | 14 | 39 | C3 | 41 | IC1 | IC2 | IC3 | IC4 | IC5 | 47 | C4 | 44 | T1 | -2.5V NOT WORKING | C7 | 8 | 11 | 10 | 6 | 5 | 4 | 7 | 23 | 24 | 55 | 56 | 45 | 46 | 49 | 50 | 48 | C1 | 30 | 28 | 27 | C6 | C8 | 4VOB
bNames: Waveshaper | Sub oscillator | Center | DCO in | Pulse VCA | PW CV | Symmetry | Pulse | Saw inv | Saw | Triangle | Sine | 2 | 1 | Saw | Sqr 2 | Sqr 1 | Saw 1 / match | Saw 2 / match | +15V | -15V | AGND | Timer in | +5V